# EAGLE design maus-blenano2-mk-1.0.1 (EAGLE 7.5.0)
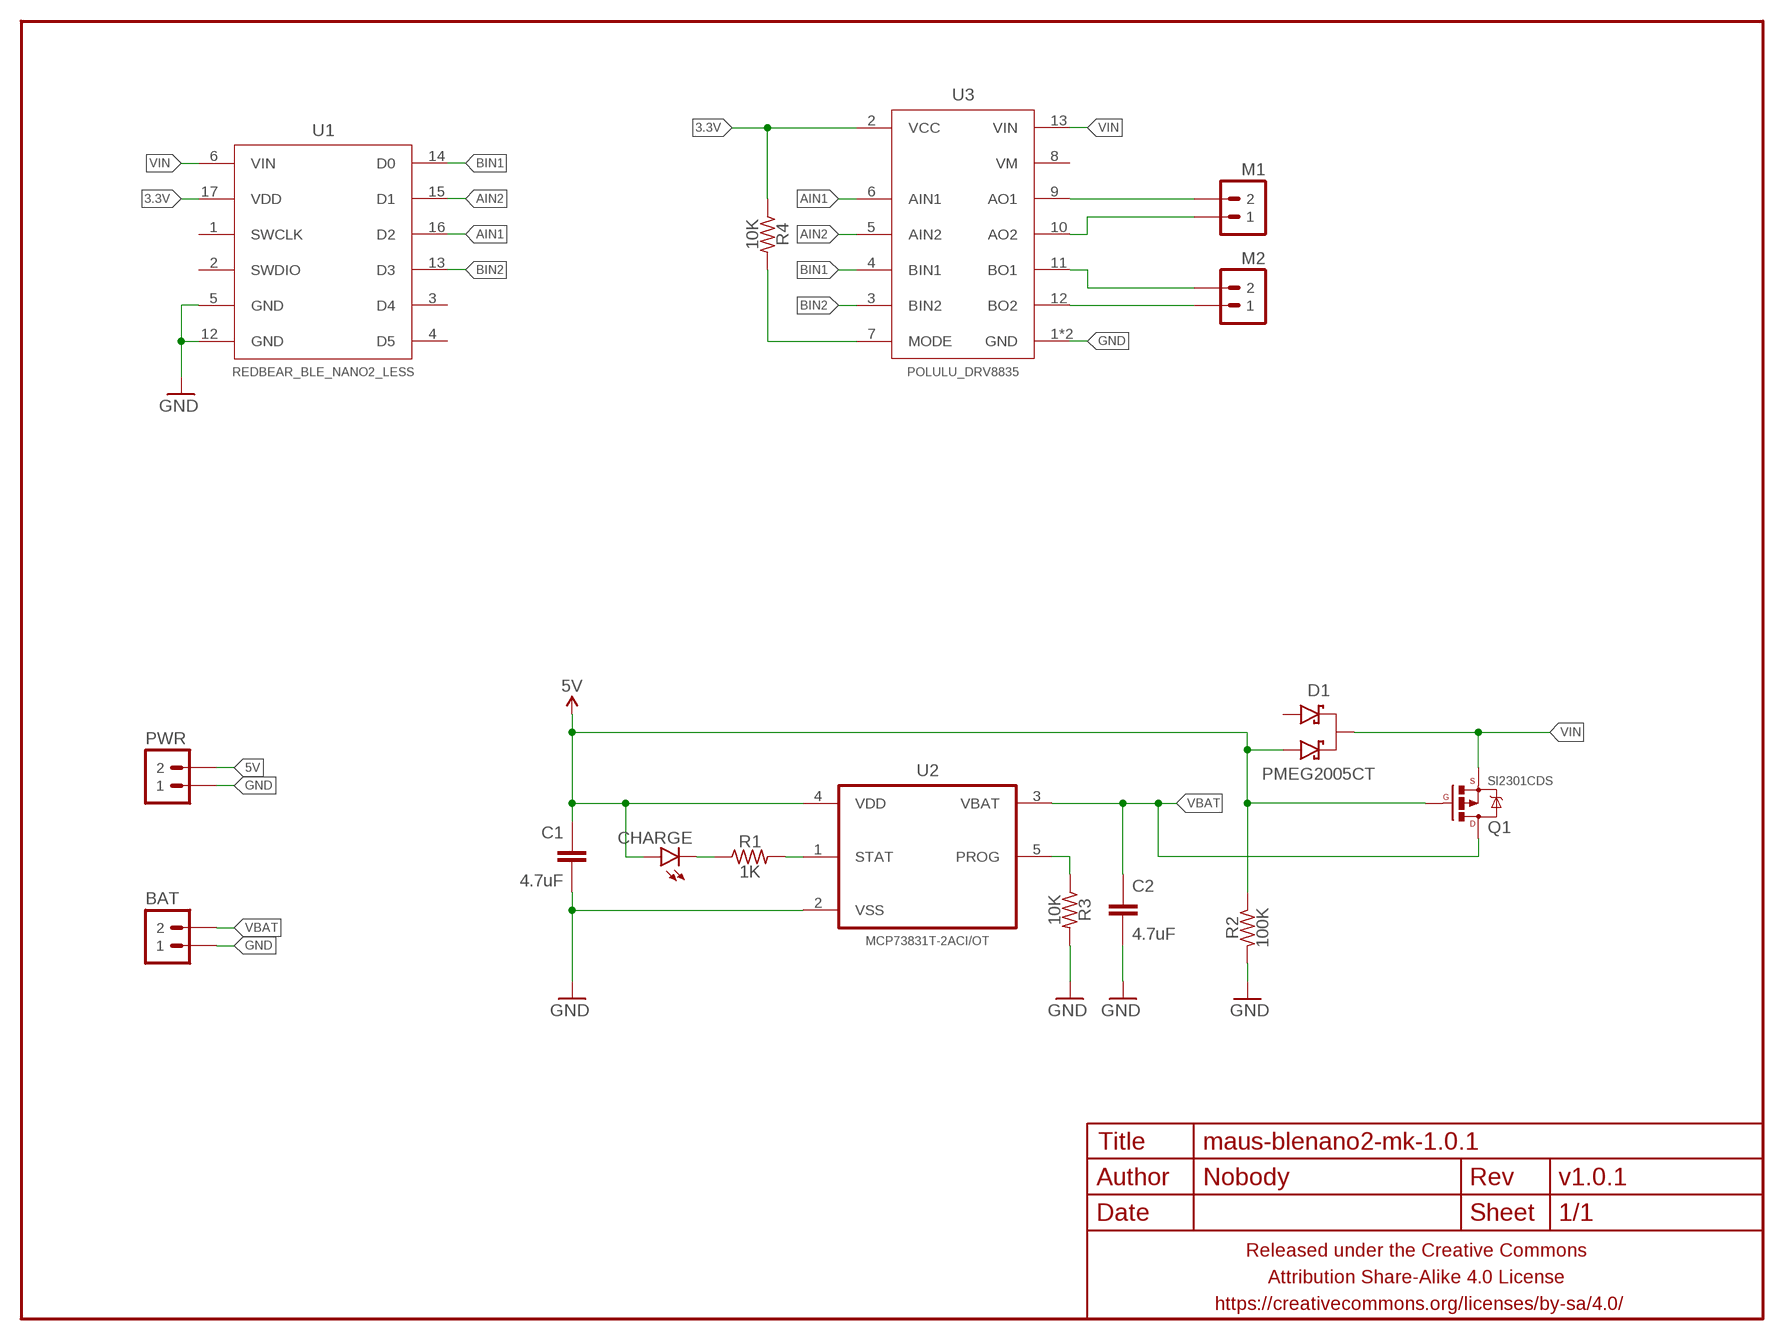
[diagram p0: schematic, sheet 1]

## Parts
BAT  M02JST-SH-RA  [JST-2-SH-RA]
C1  4.7uF  CAPACITOR-CERAMICC0603-TIGHTER  [C0603-TIGHTER]
C2  4.7uF  CAPACITOR-CERAMICC0603-TIGHTER  [C0603-TIGHTER]
CHARGE  LED0603-TIGHT  [LED-0603-TIGHT]
D1  PMEG2005CT  DIODE-SCHOTTKY-DUALPMEG2005CT  [SOT23]
FRAME1  FRAME-LETTERNO_PACKAGE  [DUMMY]
M1  M02PTH-2MM  [1X02-2MM-PTH]
M2  M02PTH-2MM  [1X02-2MM-PTH]
PWR  M02JST-SH-RA  [JST-2-SH-RA]
Q1  SI2301CDS  MOSFET-PCHANNELSOT-23  [SOT23]
R1  1K  RESISTORR0603-TIGHTER  [R0603-TIGHTER]
R2  100K  RESISTORR0603-TIGHTER  [R0603-TIGHTER]
R3  10K  RESISTORR0603-TIGHTER  [R0603-TIGHTER]
R4  10K  RESISTORR0603-TIGHTER  [R0603-TIGHTER]
U1  REDBEAR_BLE_NANO2_LESS  [REDBEAR_BLE_NANO2_LESS]
U2  MCP73831T-2ACI/OT  [SOT95P280X145-5N]
U3  POLULU_DRV8835  [POLULU_DRV8835]

## Nets
3.3V: R4.1 U1.17(VDD) U3.2(VCC)
5V: C1.1 CHARGE.A D1.2(A2) PWR.2 Q1.1(G) R2.1 U2.4(VDD)
AIN1: U1.16(D2) U3.6(AIN1)
AIN2: U1.15(D1) U3.5(AIN2)
BIN1: U1.14(D0) U3.4(BIN1)
BIN2: U1.13(D3) U3.3(BIN2)
GND: BAT.1 C1.2 C2.2 PWR.1 R2.2 R3.2 U1.5(GND) U1.12(GND) U2.2(VSS) U3.1(GND) U3.14(GND)
N$1: R1.2 U2.1(STAT)
N$2: CHARGE.C R1.1
N$3: R4.2 U3.7(MODE)
N$4: M1.P$2 U3.9(AO1)
N$5: M1.P$1 U3.10(AO2)
N$6: M2.P$2 U3.11(BO1)
N$7: M2.P$1 U3.12(BO2)
N$11: R3.1 U2.5(PROG)
VBAT: BAT.2 C2.1 Q1.3(D) U2.3(VBAT)
VIN: D1.3(K) Q1.2(S) U1.6(VIN) U3.13(VIN)
Unconnected: D1.1(A1) U1.1(SWCLK) U1.2(SWDIO) U1.3(D4) U1.4(D5) U3.8(VM)

## Library data of the parts
BAT M1 M2 PWR = a_parts:M02: Standard 2-pin 0.1" header. Use with - straight break away headers ( PRT-00116) - right angle break away headers (PRT-00553) - swiss pins (PRT-00743) - machine pins (PRT-00117) - female headers (PRT-00115) Molex polarized connector foot print use with: PRT-08233 with associated crimp pins and housings. 2.54_SCREWTERM for use with PRT-10571. 3.5mm Screw Terminal footprints for PRT-08084 5mm Screw Terminal footprints for use with PRT-08433
C1 C2 = a_parts:CAPACITOR-CERAMIC: CAPACITOR, European symbol
CHARGE = a_parts:LED: LEDs Standard schematic elements and footprints for 5mm, 3mm, 1206, and 0603 sized LEDs. 5mm - Spark Fun Electronics SKU : COM-00529 (and others)
D1 = a_parts:DIODE-SCHOTTKY-DUAL
FRAME1 = a_parts:FRAME-LETTER: Schematic Frame Standard 8.5x11 US Letter frame; DESIGNER: Nobody; VERSION: v1.0.1
Q1 = a_parts:MOSFET-PCHANNEL: Generic PMOSFET IRLML2244 - TRANS-11153 (SOT-23 -20V -4.3A) (1.Gate 2.Source 3.Drain) FQP27P06 - COM-10349 <http://www.sparkfun.com/products/10349> (TO-220 -60V -27A) (1.Gate 2.Source 3.Drain)
R1-R4 = a_parts:RESISTOR: RESISTOR, American symbol
U1 = a_parts:REDBEAR_BLE_NANO2_LESS
U2 = a_parts:MCP73831T-2ACI/OT: Charge Management Controller; MPN: MCP73831T-2ACI/OT; OC_FARNELL: 1332158; OC_NEWARK: 56K7045; PACKAGE: SOT-5; SUPPLIER: Microchip
U3 = a_parts:POLULU_DRV8835

## Board
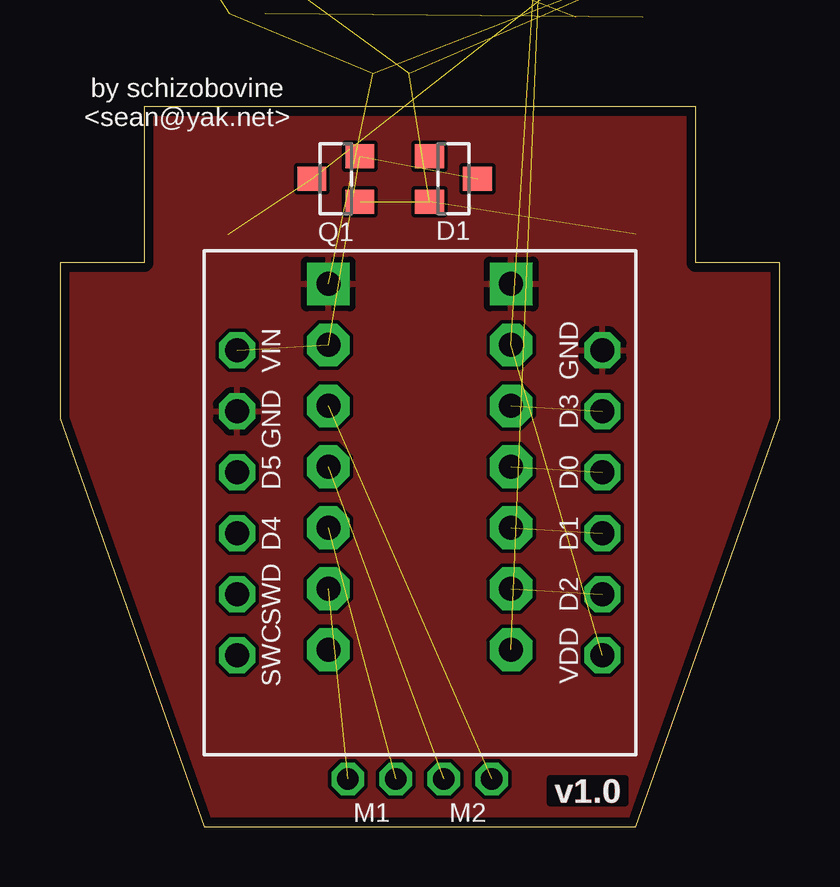
[diagram p1: board, top side]
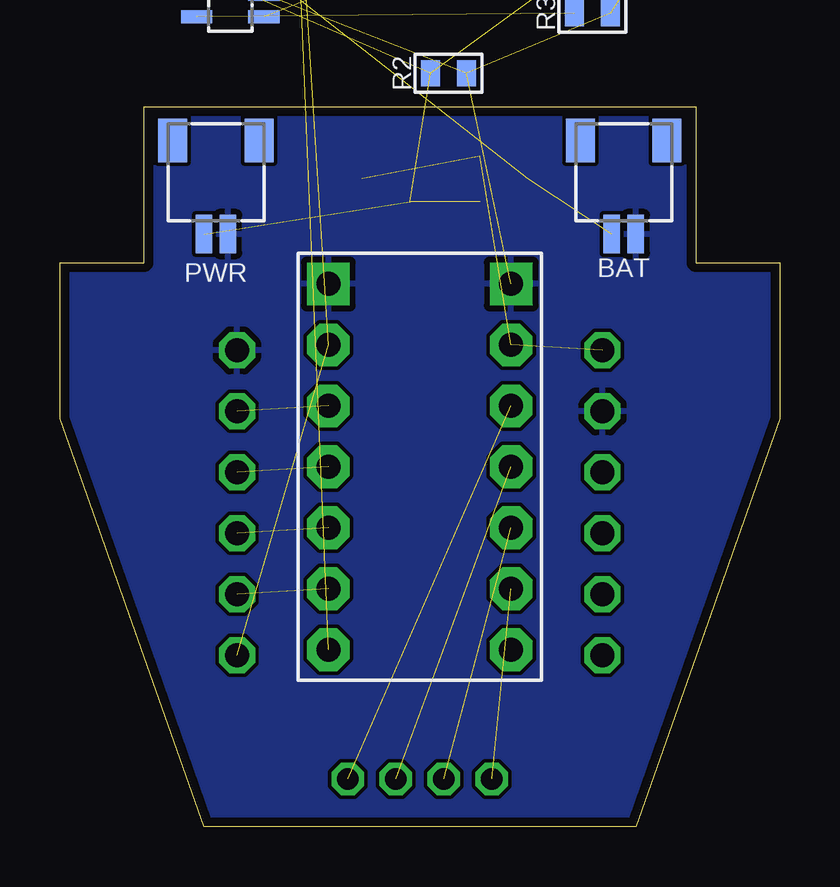
[diagram p2: board, bottom side, seen from below]

Size 30 x 30 mm. Coordinates in mm from the lower left corner, seen from the top.
Outline: 3.5,30 3.5,23.5 0,23.5 0,17 6,0 24,0 30,17 30,23.5 26.5,23.5 26.5,30 3.5,30
Copper layers (1*16): Top 0.0356mm / dielectric 1.5011mm / Bottom 0.0356mm
Design rules "LaenPCBOrder2": minimum track width 6mil, minimum drill 13mil, track to track 6mil, track to pad 6mil, pad to pad 6mil, via to via 6mil, smd to smd 6mil, copper to edge 15mil, drill to drill 6mil, minimum pad ring 7mil, minimum via ring 7mil, stop-mask expansion 3mil, vias tented up to drill 20mil, thermal gap 10mil

### Footprints (pad centres in the part's own frame; a part is rotated, then mirrored left to right if it is on the bottom)
JST-2-SH-RA = smd 0.7 x 1.6: 1 -0.5,4.8; 2 0.5,4.8 | smd 1.2 x 1.8: P$1 -1.8,0.9; P$2 1.8,0.9
C0603-TIGHTER = smd 0.8 x 1.1: 1 -0.75,0; 2 0.75,0
LED-0603-TIGHT = smd 0.8 x 1.1: A 0.75,0; C -0.75,0
SOT23 = smd 1 x 1.2: 1 -0.95,-1; 2 0.95,-1; 3 0,1
1X02-2MM-PTH = drill 0.9 octagon: P$1 -1,0; P$2 1,0
R0603-TIGHTER = smd 0.8 x 1.1: 1 -0.75,0; 2 0.75,0
REDBEAR_BLE_NANO2_LESS = drill 1 octagon: 1 7.62,6.35; 2 7.62,3.81; 3 7.62,1.27; 4 7.62,-1.27; 5 7.62,-3.81; 6 7.62,-6.35; 12 -7.62,-6.35; 13 -7.62,-3.81; 14 -7.62,-1.27; 15 -7.62,1.27; 16 -7.62,3.81; 17 -7.62,6.35
SOT95P280X145-5N = smd 1.3 x 0.55: 1 -1.4,0.95; 2 -1.4,0; 3 -1.4,-0.95; 4 1.4,-0.95; 5 1.4,0.95
POLULU_DRV8835 = drill 1 pad 1.778 square: 1 -3.81,7.62; 14 3.81,7.62 | drill 1 pad 1.778 octagon: 2 -3.81,5.08; 3 -3.81,2.54; 4 -3.81,0; 5 -3.81,-2.54; 6 -3.81,-5.08; 7 -3.81,-7.62; 8 3.81,-7.62; 9 3.81,-5.08; 10 3.81,-2.54; 11 3.81,0; 12 3.81,2.54; 13 3.81,5.08

### Placement (x,y rotation side)
BAT  6.5,29.5 180 bottom
C1  5.3,37.4 270 bottom  (outside the outline)
C2  12.2,42 0 bottom  (outside the outline)
CHARGE  25.1,37.6 270 top  (outside the outline)
D1  16.4,27 270 top
FRAME1  0,0 0 top
M1  13,2 180 top
M2  17,2 180 top
PWR  23.5,29.5 180 bottom
Q1  11.5,27 90 top
R1  16,35.6 180 bottom  (outside the outline)
R2  13.8,31.4 0 bottom
R3  7.8,33.9 0 bottom  (outside the outline)
R4  20.2,41.2 270 bottom  (outside the outline)
U1  15,13.5 180 top
U2  22.9,34.7 180 bottom  (outside the outline)
U3  15,15 0 bottom

### Tracks (layer width: path | path; a pad name or v marks a point on that pad's centre or on a via)
3.3V  (2 unrouted)
5V  (6 unrouted)
AIN1  (1 unrouted)
AIN2  (1 unrouted)
BIN1  (1 unrouted)
BIN2  (1 unrouted)
GND  (5 unrouted)
  pour Top (rank 6): 3.5,30 3.5,23.5 0,23.5 0,17 6,0 24,0 30,17 30,23.5 26.5,23.5 26.5,30
  pour Bottom (rank 6): 3.5,30 3.5,23.5 0,23.5 0,17 6,0 24,0 30,17 30,23.5 26.5,23.5 26.5,30
N$1  (1 unrouted)
N$2  (1 unrouted)
N$3  (1 unrouted)
N$4  (1 unrouted)
N$5  (1 unrouted)
N$6  (1 unrouted)
N$7  (1 unrouted)
N$11  (1 unrouted)
VBAT  (3 unrouted)
VIN  (3 unrouted)

### Text on the board
Top: BleuMaus
tPlace: by schizobovine / <sean@yak.net> | BleuMaus